# EAGLE design ZX Loader (EAGLE 9.6.1)
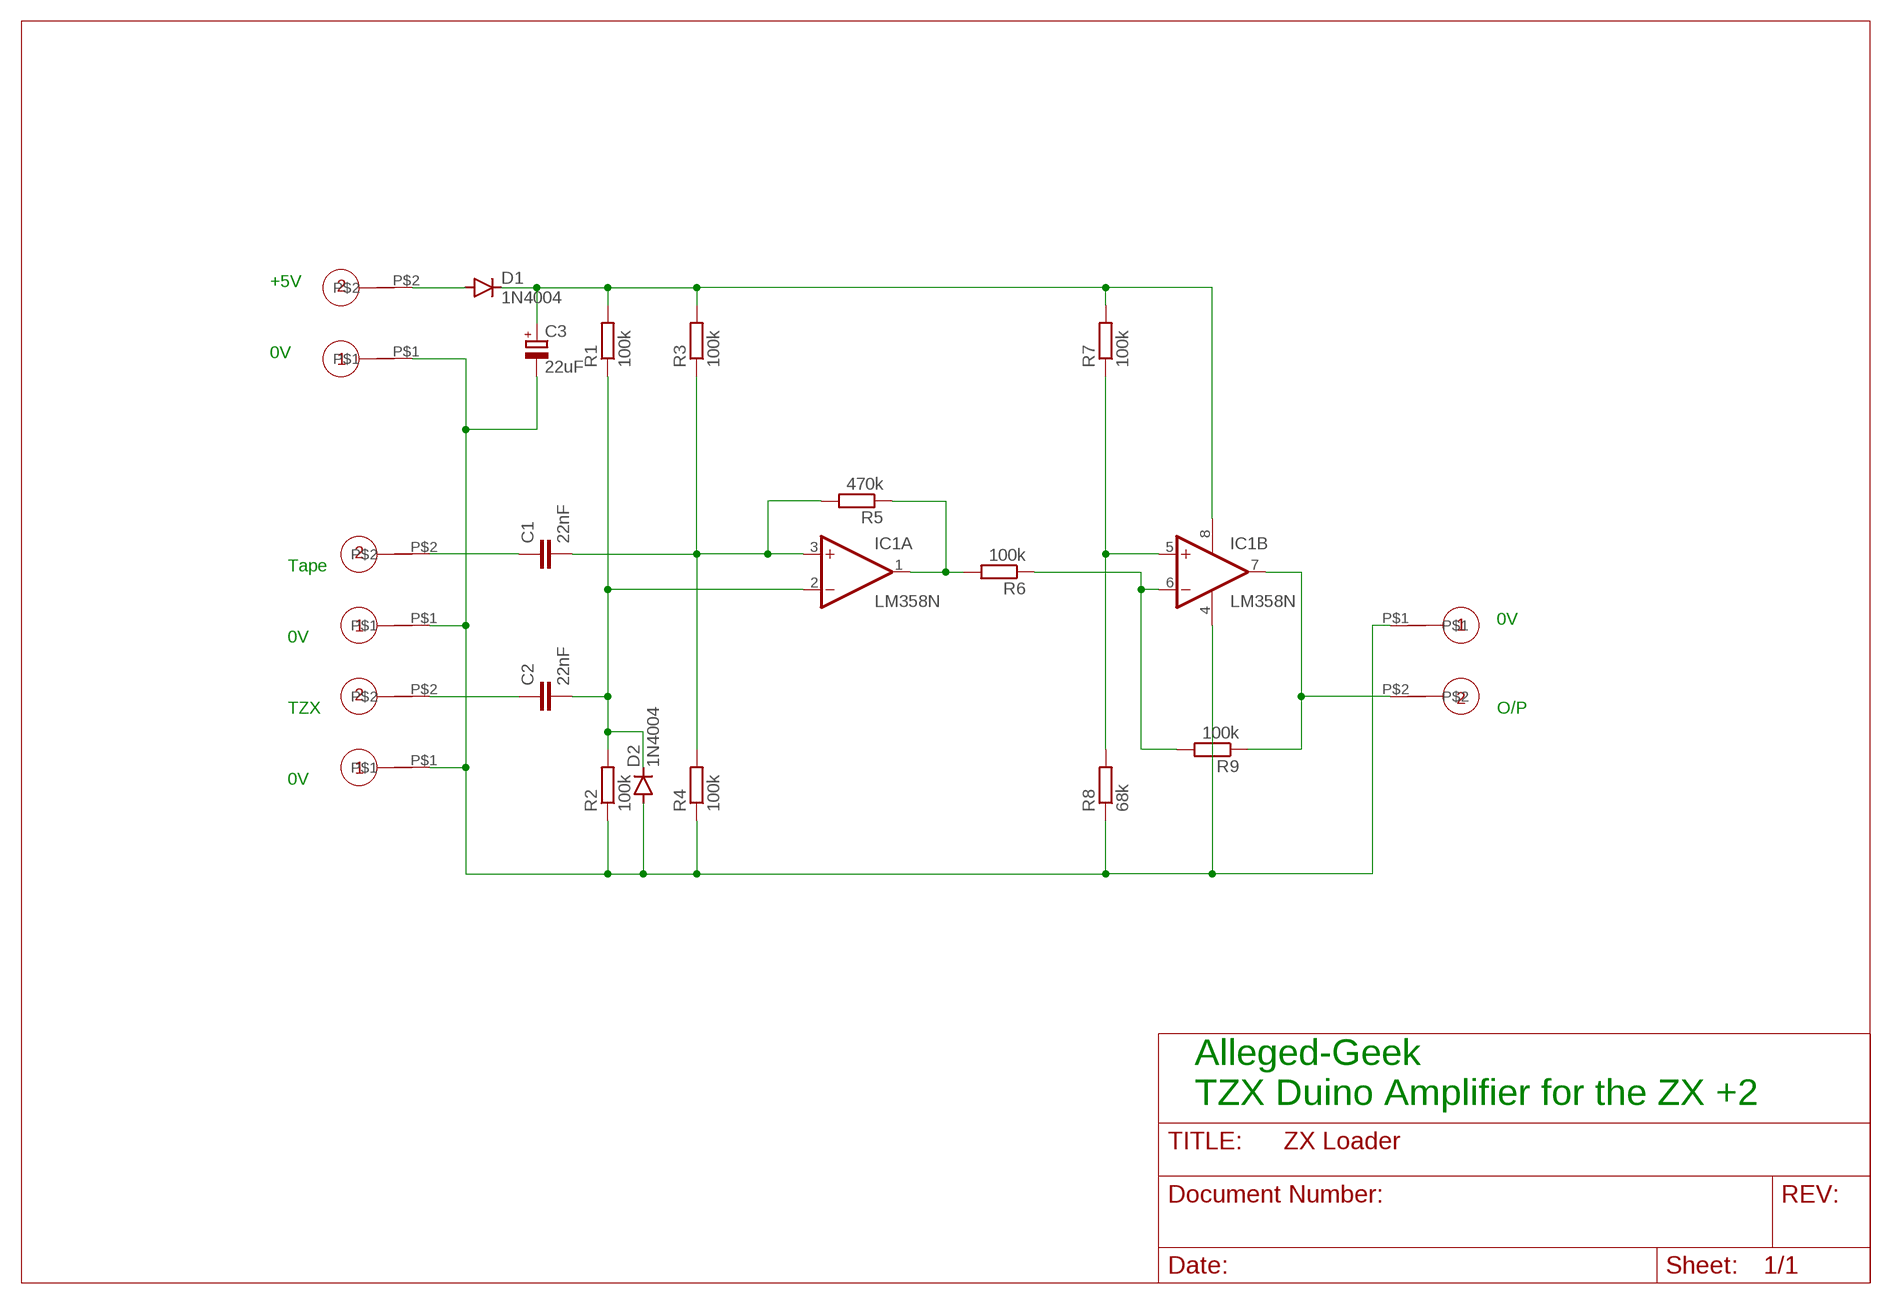
[diagram p0: schematic, sheet 1]

## Parts
C1  22nF  C-EU050-030X075  [C050-030X075]
C2  22nF  C-EU050-030X075  [C050-030X075]
C3  22uF  CPOL-EUE2.5-5  [E2,5-5]
D1  1N4004  [DO41-10]
D2  1N4004  [DO41-10]
IC1  LM358N  [DIL08]
O/P  RGU-A2-PUSH-BUTTON-CONNECTOR  [RGU-A2]
POWER  Power  RGU-A2-PUSH-BUTTON-CONNECTOR  [RGU-A2]
R1  100k  RGU-RESISTOR-207/10  [0207/10]
R2  100k  RGU-RESISTOR-207/10  [0207/10]
R3  100k  RGU-RESISTOR-207/10  [0207/10]
R4  100k  RGU-RESISTOR-207/10  [0207/10]
R5  470k  RGU-RESISTOR-207/10  [0207/10]
R6  100k  RGU-RESISTOR-207/10  [0207/10]
R7  100k  RGU-RESISTOR-207/10  [0207/10]
R8  68k  RGU-RESISTOR-207/10  [0207/10]
R9  100k  RGU-RESISTOR-207/10  [0207/10]
TZX  RGU-A2-PUSH-BUTTON-CONNECTOR  [RGU-A2]
U2  Tape  RGU-A2-PUSH-BUTTON-CONNECTOR  [RGU-A2]

## Nets
0V: C3.- D2.A IC1.4(P:V-) O/P.P$1 POWER.P$1 R2.1 R4.1 R8.1 TZX.P$1 U2.P$1
5V: D1.A POWER.P$2
+V: C3.+ D1.C IC1.8(P:V+) R1.2 R3.2 R7.2
EXT-I/P: C2.1 TZX.P$2
INT-I/P: C1.1 U2.P$2
N$6: C2.2 D2.C IC1.2(A:-IN) R1.1 R2.2
N$7: C1.2 IC1.3(A:+IN) R3.1 R4.2 R5.2
N$8: IC1.6(B:-IN) R6.1 R9.2
N$9: IC1.1(A:OUT) R5.1 R6.2
N$11: IC1.5(B:+IN) R7.1 R8.2
O/P: IC1.7(B:OUT) O/P.P$2 R9.1

## Notes on the sheet
- +5V
- 0V
- Tape
- 0V
- 0V
- TZX | O/P
- 0V
- Alleged-Geek
  TZX Duino Amplifier for the ZX +2

## Library data of the parts
C1 C2 = rcl:C-EU: CAPACITOR, European symbol; SPICEPREFIX: C
C3 = rcl:CPOL-EU: POLARIZED CAPACITOR, European symbol; SPICEPREFIX: C
D1 D2 = diode:1N4004: DIODE general purpose rectifier, 1 A
IC1 = linear:LM358: OP AMP also LM158; LM258; LM2904 Source: http://cache.national.com/ds/LM/LM158.pdf
O/P POWER TZX U2 = RGU-StoresParts:RGU-A2-PUSH-BUTTON-CONNECTOR; MF: Rapid; MPN: 21-2626
R1-R9 = RGU-StoresParts:RGU-RESISTOR-207/10

## Board
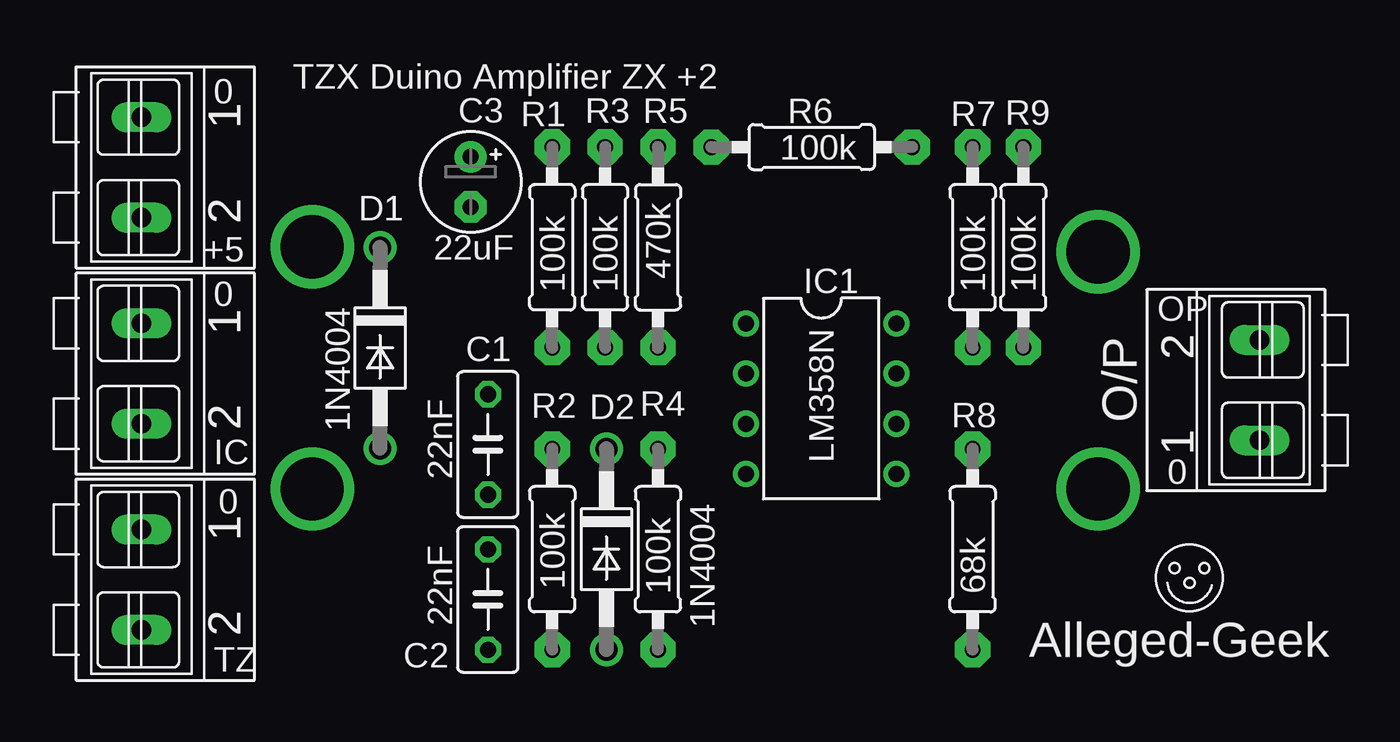
[diagram p1: board, top side]
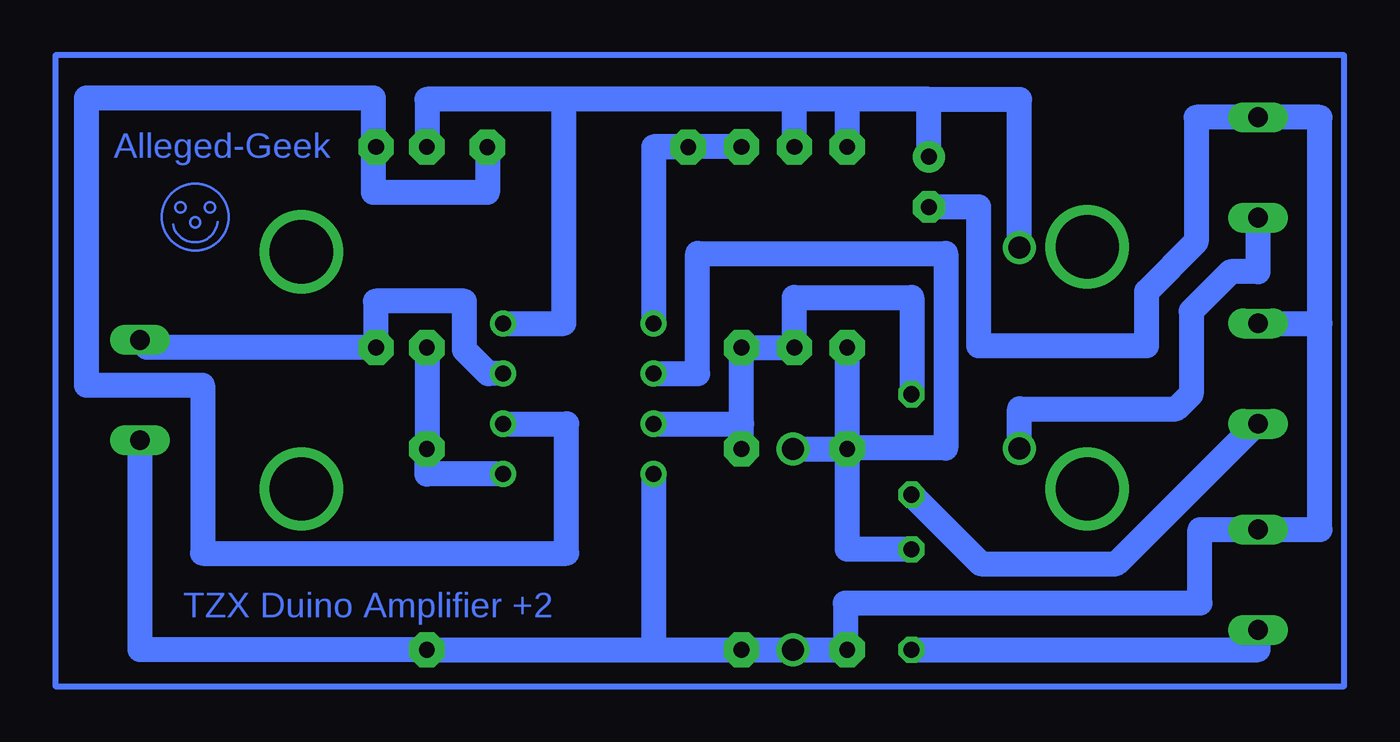
[diagram p2: board, bottom side, seen from below]

No outline drawn. Coordinates in mm, seen from the top.
Copper layers (1*16): Top 0.035mm / dielectric 1.5mm / Bottom 0.035mm
Design rules "default": minimum track width 6mil, minimum drill 0.35mm, track to track 6mil, track to pad 6mil, pad to pad 6mil, via to via 6mil, smd to smd 6mil, copper to edge 40mil, drill to drill 6mil, minimum pad ring 10mil, minimum via ring 8mil, stop-mask expansion 4mil, vias tented up to drill 0mil, thermal gap 10mil

### Footprints (pad centres in the part's own frame; a part is rotated, then mirrored left to right if it is on the bottom)
C050-030X075 = drill 0.813 octagon: 1 -2.54,0; 2 2.54,0
E2,5-5 = drill 0.813 pad 1.6: + -1.27,0 | drill 0.813 pad 1.6 octagon: - 1.27,0
DO41-10 = drill 1.118: A 5.08,0; C -5.08,0
DIL08 = drill 0.813 pad 1.27: 1 -3.81,-3.81; 2 -1.27,-3.81; 3 1.27,-3.81; 4 3.81,-3.81; 5 3.81,3.81; 6 1.27,3.81; 7 -1.27,3.81; 8 -3.81,3.81
RGU-A2 = drill 1 long: P$1 7.62,5.715; P$2 2.54,5.715
0207/10 = drill 0.8 pad 1.778 octagon: 1 -5.08,0; 2 5.08,0

### Placement (x,y rotation side)
C1  21.89,12.25 90 top
C2  21.89,4.41 90 top
C3  21.01,25.54 270 top
D1  16.43,17.13 270 top
D2  27.88,6.95 270 top
IC1  38.75,14.57 270 top
O/P  55.21,20.08 270 top
POWER  10.08,21.19 90 top
R1  25.14,22.23 90 top
R2  25.14,6.95 90 top
R3  27.82,22.23 90 top
R4  30.49,6.95 90 top
R5  30.49,22.23 270 top
R6  38.27,27.3 180 top
R7  46.41,22.23 90 top
R8  46.41,6.95 90 top
R9  48.97,22.23 90 top
TZX  10.08,0.33 90 top
U2  10.08,10.76 90 top

### Tracks (layer width: path | path; a pad name or v marks a point on that pad's centre or on a via)
0V
  Bottom 1.27: 1.24,18.38 1.24,7.95 TZX.P$1 7.31,7.95 7.31,4.23 25.25,4.23 25.25,1.97 R2.1 D2.A R4.1 34.94,1.87 | 1.24,18.38 1.24,28.81 POWER.P$1 7.49,28.81 7.49,22.51 10,20 10,17.25 18.5,17.25 18.5,24.27 C3.- | U2.P$1 1.24,18.38 | 34.94,1.87 R8.1 60.92,1.87 O/P.P$1 | IC1.4 34.94,1.87
5V
  Bottom 1.27: 16.5,12.12 D1.A 16.43,14.05 8.5,14.05 7.75,14.8 7.75,19 5.75,21 4.36,21 POWER.P$2
+V
  Bottom 1.27: 21.02,29.71 16.43,29.71 D1.C | 21.02,29.71 25.14,29.71 | 25.14,29.71 27.82,29.71 | 27.82,29.71 39.47,29.71 | 39.47,29.71 46.41,29.71 R7.2 | C3.+ 21.02,29.71 | R1.2 25.14,29.71 | R3.2 27.82,29.71 | IC1.8 39.47,18.38 39.47,29.71
EXT-I/P
  Bottom 1.27: C2.1 4.36,1.87 TZX.P$2
INT-I/P
  Bottom 1.27: U2.P$2 4.45,13.3 11.54,6.21 18.39,6.21 C1.1
N$1  (via drill 3.2)
  other vias: 13,22.25
N$2  (via drill 3.2)
  other vias: 13,10
N$3  (via drill 3.2)
  other vias: 52.75,10
N$4  (via drill 3.2)
  other vias: 52.75,22
N$6
  Bottom 1.27: C2.2 25.14,6.95 R2.2 | D2.C R2.2 | R2.2 25.14,12.07 | 25.14,12.07 R1.1 | IC1.2 32.72,15.84 32.72,21.91 20.16,21.91 20.16,12.07 25.14,12.07
N$7
  Bottom 1.27: R4.2 30.49,13.3 | 30.49,13.3 R5.2 R3.1 27.82,19.69 21.88,19.69 C1.2 | IC1.3 30.49,13.3
N$8
  Bottom 1.27: 48.97,27.3 R9.2 49.11,27.31 | IC1.6 39.34,13.3 39.34,6.75 57.75,6.75 57.75,15.25 63.62,15.25 63.62,29.8 49.11,29.8 49.11,27.31 | R6.1 43.35,25 49.11,25 49.11,27.31
N$9
  Bottom 1.27: R5.1 34.94,27.31 34.94,27.3 | 34.94,27.3 IC1.1 | R6.2 34.94,27.3
N$10
  Bottom 0.127: 59.25,23.38 arc-161 57,23.5
N$11
  Bottom 1.27: IC1.5 46.41,10.76 R8.2 R7.1
N$12
  Bottom 0.305: 0.01,31.94 65.19,31.94 65.19,0.02 0.01,0.02 0.01,31.94
O/P
  Bottom 1.27: 60.82,17.65 O/P.P$2 60.57,17.18 49,17.18 | IC1.7 43.31,15.84 44.5,17.03 44.5,19.5 49,19.5 49,17.18 | 49,17.18 R9.1
(copper drawn outside any net)
  shapes: Bottom circle x4

### Text on the board
Bottom: Alleged-Geek | TZX Duino Amplifier +2
tPlace: 0 | TZX Duino Amplifier ZX +2 | +5 | 0 | OP | IC | 0 | 0 | Alleged-Geek | TZ